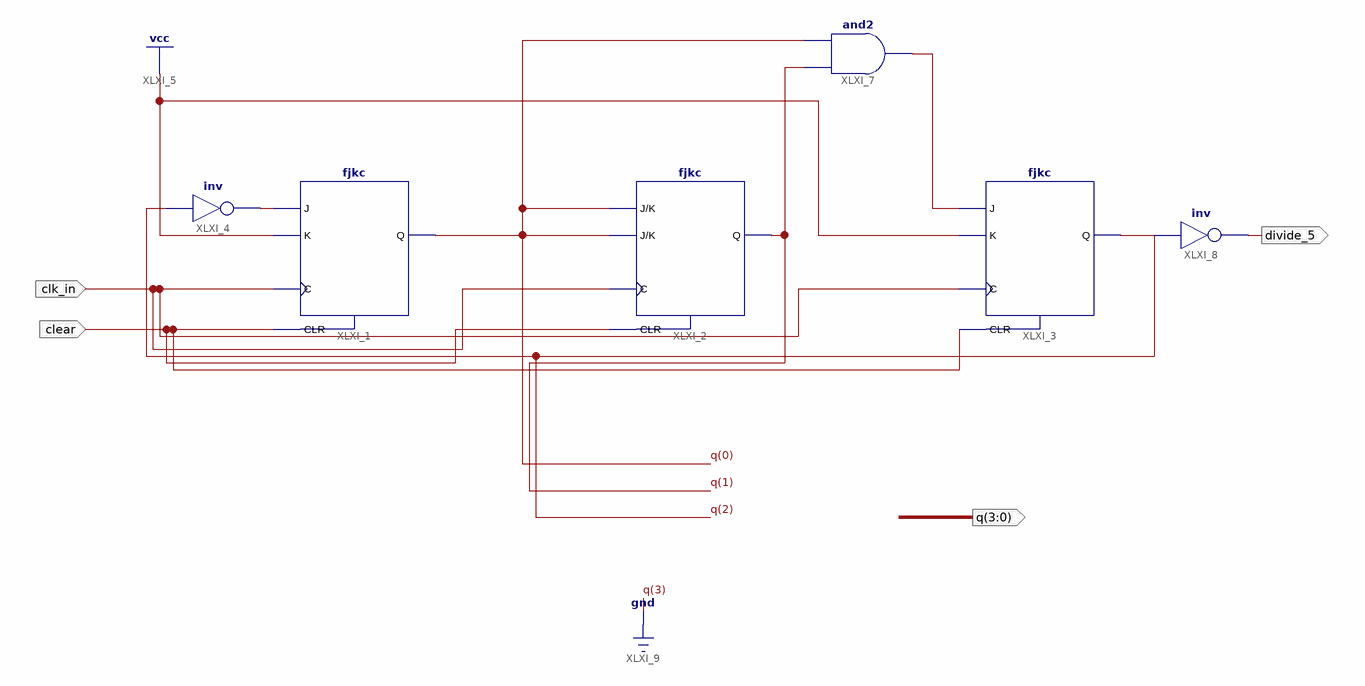
[diagram p0: schematic sheet 1]
// Xilinx ISE schematic counter04.sch (spartan6) as structural Verilog: 6 symbols, 4 ports
module counter04 (
  input  clear,
  input  clk_in,
  output divide_5,
  output [3:0] q
);

  wire XLXN_1, XLXN_7;

  fjkc XLXI_1 (.C(clk_in), .CLR(clear), .J(XLXN_1), .K(1'b1), .Q(q[0]));
  fjkc XLXI_2 (.C(clk_in), .CLR(clear), .J(q[0]), .K(q[0]), .Q(q[1]));
  fjkc XLXI_3 (.C(clk_in), .CLR(clear), .J(XLXN_7), .K(1'b1), .Q(q[2]));
  not XLXI_4 (XLXN_1, q[2]);
  and XLXI_7 (XLXN_7, q[1], q[0]);
  not XLXI_8 (divide_5, q[2]);

  assign q[3] = 1'b0;
endmodule
